# Altium schematic sheet Capteur.SchDoc
size A4; Author: Audran; CompanyName: Goldorak; Address1: Electrolab; Address2: 52 rue Paul Lescop; Address3: 92000 Nanterre; DocumentNumber: 5; SheetNumber: 5; SheetTotal: 8; ProjectName: Cartes_2017
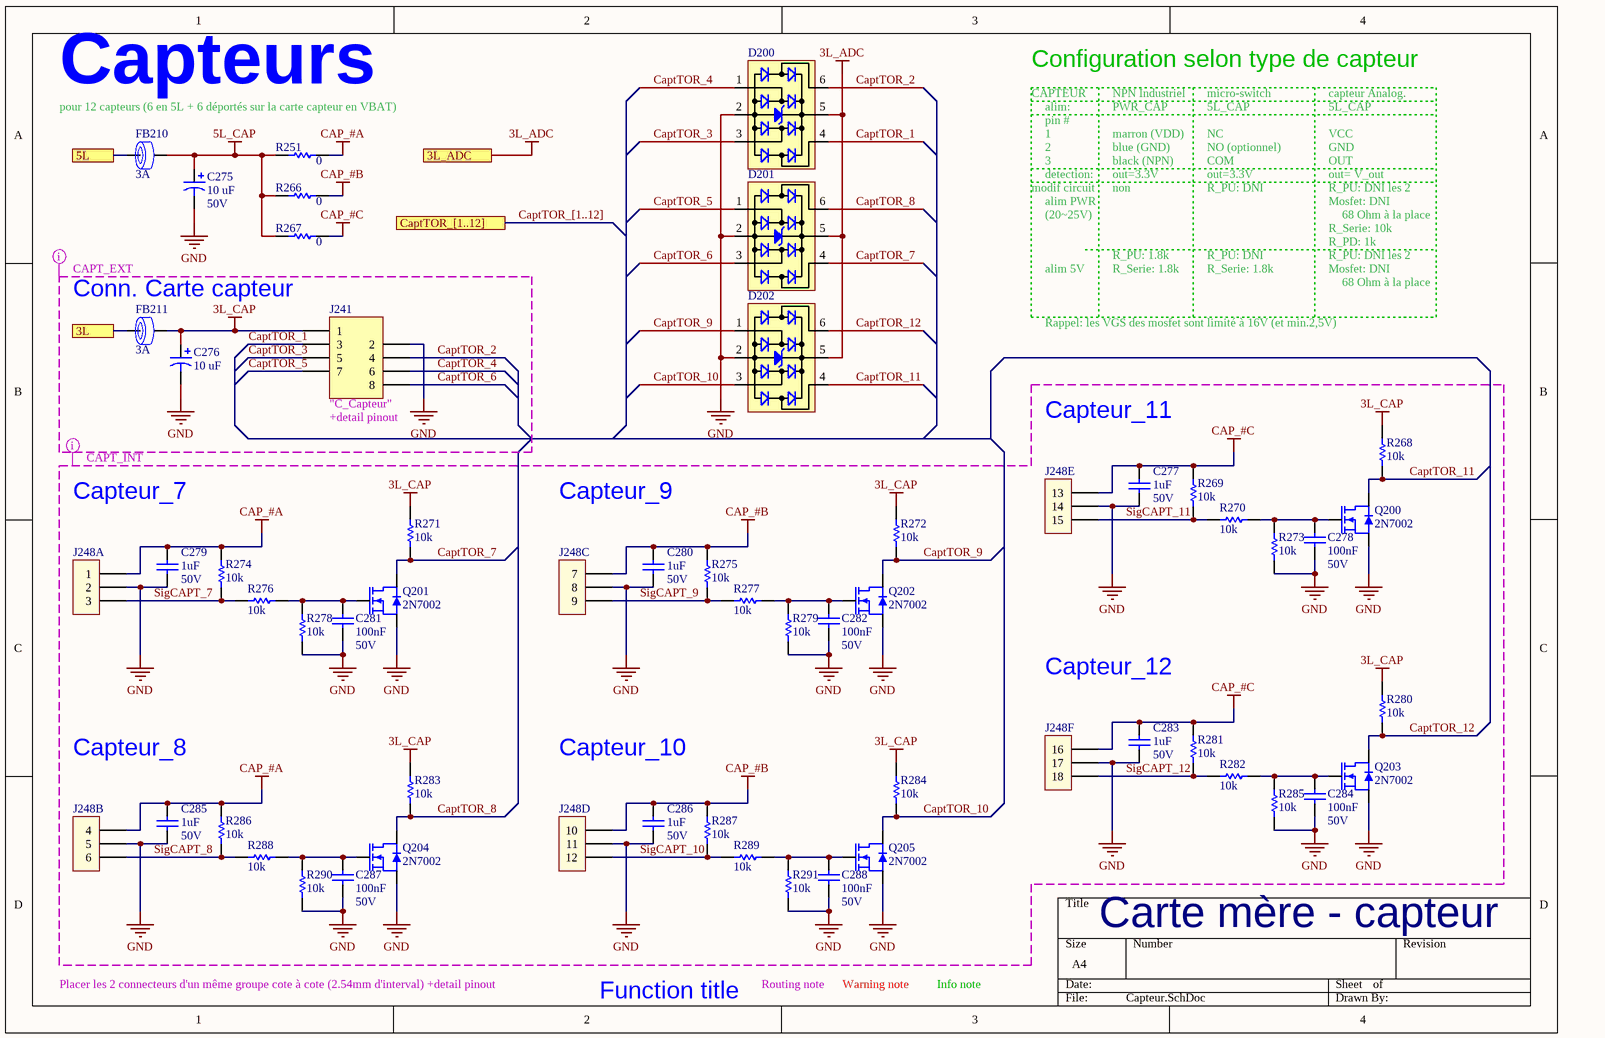
[diagram p0: Capteur.SchDoc]

## Parts
C275  10 uF  RatedVoltage: 50V  [WCAP-ATG8_5x11x2x0.5]
C276  10 uF  [WCAP-ATG8_5x11x2x0.5]
C277  1uF  RatedVoltage: 50V  [WCAP-CSGP_0805, 2x1.25x1.25]
C278  100nF  RatedVoltage: 50V  [WCAP-CSGP_0603, 1.6x0.8x0.8]
C279  1uF  RatedVoltage: 50V  [WCAP-CSGP_0805, 2x1.25x1.25]
C280  1uF  RatedVoltage: 50V  [WCAP-CSGP_0805, 2x1.25x1.25]
C281  100nF  RatedVoltage: 50V  [WCAP-CSGP_0603, 1.6x0.8x0.8]
C282  100nF  RatedVoltage: 50V  [WCAP-CSGP_0603, 1.6x0.8x0.8]
C283  1uF  RatedVoltage: 50V  [WCAP-CSGP_0805, 2x1.25x1.25]
C284  100nF  RatedVoltage: 50V  [WCAP-CSGP_0603, 1.6x0.8x0.8]
C285  1uF  RatedVoltage: 50V  [WCAP-CSGP_0805, 2x1.25x1.25]
C286  1uF  RatedVoltage: 50V  [WCAP-CSGP_0805, 2x1.25x1.25]
C287  100nF  RatedVoltage: 50V  [WCAP-CSGP_0603, 1.6x0.8x0.8]
C288  100nF  RatedVoltage: 50V  [WCAP-CSGP_0603, 1.6x0.8x0.8]
D200  824001  [SOT-23-6L]  (value not drawn)
D201  824001  [SOT-23-6L]  (value not drawn)
D202  824001  [SOT-23-6L]  (value not drawn)
FB210  RatedCurrent: 3A  [WE-CBF_0805_High Current]  (hidden comment: 742792023)
FB211  RatedCurrent: 3A  [WE-CBF_0805_High Current]  (hidden comment: 742792023)
J241  690367280876  [690367280876]  (value not drawn)
J248  TSW-106-08-F-T-RA  [TSW-106-08-F-T-RA]  (value not drawn)  (parts A,B,C,D,E,F of 6)
Q200  2N7002  [SOT-23]
Q201  2N7002  [SOT-23]
Q202  2N7002  [SOT-23]
Q203  2N7002  [SOT-23]
Q204  2N7002  [SOT-23]
Q205  2N7002  [SOT-23]
R251  value 0  [RESC1608X06N]  (hidden comment: RC0603FR-070RL)
R266  value 0  [RESC1608X06N]  (hidden comment: RC0603FR-070RL)
R267  value 0  [RESC1608X06N]  (hidden comment: RC0603FR-070RL)
R268  value 10k  [RESC1608X06N]  (hidden comment: RC0603FR-0710KL)
R269  value 10k  [RESC1608X06N]  (hidden comment: RC0603FR-0710KL)
R270  value 10k  [RESC1608X06N]  (hidden comment: RC0603FR-0710KL)
R271  value 10k  [RESC1608X06N]  (hidden comment: RC0603FR-0710KL)
R272  value 10k  [RESC1608X06N]  (hidden comment: RC0603FR-0710KL)
R273  value 10k  [RESC1608X06N]  (hidden comment: RC0603FR-0710KL)
R274  value 10k  [RESC1608X06N]  (hidden comment: RC0603FR-0710KL)
R275  value 10k  [RESC1608X06N]  (hidden comment: RC0603FR-0710KL)
R276  value 10k  [RESC1608X06N]  (hidden comment: RC0603FR-0710KL)
R277  value 10k  [RESC1608X06N]  (hidden comment: RC0603FR-0710KL)
R278  value 10k  [RESC1608X06N]  (hidden comment: RC0603FR-0710KL)
R279  value 10k  [RESC1608X06N]  (hidden comment: RC0603FR-0710KL)
R280  value 10k  [RESC1608X06N]  (hidden comment: RC0603FR-0710KL)
R281  value 10k  [RESC1608X06N]  (hidden comment: RC0603FR-0710KL)
R282  value 10k  [RESC1608X06N]  (hidden comment: RC0603FR-0710KL)
R283  value 10k  [RESC1608X06N]  (hidden comment: RC0603FR-0710KL)
R284  value 10k  [RESC1608X06N]  (hidden comment: RC0603FR-0710KL)
R285  value 10k  [RESC1608X06N]  (hidden comment: RC0603FR-0710KL)
R286  value 10k  [RESC1608X06N]  (hidden comment: RC0603FR-0710KL)
R287  value 10k  [RESC1608X06N]  (hidden comment: RC0603FR-0710KL)
R288  value 10k  [RESC1608X06N]  (hidden comment: RC0603FR-0710KL)
R289  value 10k  [RESC1608X06N]  (hidden comment: RC0603FR-0710KL)
R290  value 10k  [RESC1608X06N]  (hidden comment: RC0603FR-0710KL)
R291  value 10k  [RESC1608X06N]  (hidden comment: RC0603FR-0710KL)

## Ports
3L, 3L_ADC, 5L, CaptTOR_[1..12]

## Nets
3L_ADC: D200.5 D201.5 D202.5 ; port 3L_ADC
3L_CAP: C276.1 FB211.2 J241.1 R268.2 R271.2 R272.2 R280.2 R283.2 R284.2
5L_CAP: C275.1 FB210.2 R251.1 R266.1 R267.1
CAP_#A: C279.2 C285.2 J248.1 J248.4 R251.2 R274.2 R286.2
CAP_#B: C280.2 C286.2 J248.7 J248.10 R266.2 R275.2 R287.2
CAP_#C: C277.2 C283.2 J248.13 J248.16 R267.2 R269.2 R281.2
GND: C275.2 C276.2 C277.1 C278.2 C279.1 C280.1 C281.2 C282.2 C283.1 C284.2 C285.1 C286.1 C287.2 C288.2 D200.2 D201.2 D202.2 J241.2 J248.2 J248.5 J248.8 J248.11 J248.14 J248.17 Q200.2(S) Q201.2(S) Q202.2(S) Q203.2(S) Q204.2(S) Q205.2(S) R273.1 R278.1 R279.1 R285.1 R290.1 R291.1
3L: FB211.1 ; port 3L
5L: FB210.1 ; port 5L
CaptTOR_1: D200.4 J241.3
CaptTOR_2: D200.6 J241.4
CaptTOR_3: D200.3 J241.5
CaptTOR_4: D200.1 J241.6
CaptTOR_5: D201.1 J241.7
CaptTOR_6: D201.3 J241.8
CaptTOR_7: D201.4 Q201.3(D) R271.1
CaptTOR_8: D201.6 Q204.3(D) R283.1
CaptTOR_9: D202.1 Q202.3(D) R272.1
CaptTOR_10: D202.3 Q205.3(D) R284.1
CaptTOR_11: D202.4 Q200.3(D) R268.1
CaptTOR_12: D202.6 Q203.3(D) R280.1
SigCAPT_7: J248.3 R274.1 R276.1
SigCAPT_8: J248.6 R286.1 R288.1
SigCAPT_9: J248.9 R275.1 R277.1
SigCAPT_10: J248.12 R287.1 R289.1
SigCAPT_11: J248.15 R269.1 R270.1
SigCAPT_12: J248.18 R281.1 R282.1
NetC278_1: C278.1 Q200.1(G) R270.2 R273.2
NetC281_1: C281.1 Q201.1(G) R276.2 R278.2
NetC282_1: C282.1 Q202.1(G) R277.2 R279.2
NetC284_1: C284.1 Q203.1(G) R282.2 R285.2
NetC287_1: C287.1 Q204.1(G) R288.2 R290.2
NetC288_1: C288.1 Q205.1(G) R289.2 R291.2

## Buses and harness runs
bus CaptTOR_[1..12] = port CaptTOR_[1..12]

## Layout directives
net class CAPT_INT: 3L_CAP, CAP_#A, CAP_#B, CAP_#C, CaptTOR_7, CaptTOR_8, CaptTOR_9, CaptTOR_10, CaptTOR_11, CaptTOR_12, GND, SigCAPT_7, SigCAPT_8, SigCAPT_9, SigCAPT_10, SigCAPT_11, SigCAPT_12
net class CAPT_EXT: 3L_CAP, CaptTOR_1, CaptTOR_2, CaptTOR_3, CaptTOR_4, CaptTOR_5, CaptTOR_6, GND

## Notes on the sheet
- pour 12 capteurs (6 en 5L + 6 déportés sur la carte capteur en VBAT)
- Capteurs
- CAPTEUR
- Configuration selon type de capteur
- alim:
- NPN Industriel
- PWR_CAP
- micro-switch
- 5L_CAP
- capteur Analog.
- pin #
- 1
- 2
- 3
- detection:
- marron (VDD)
- blue (GND)
- black (NPN)
- out=3.3V
- NC
- NO (optionnel)
- COM
- VCC
- OUT
- GND
- out= V_out
- modif circuit
- alim PWR
- (20~25V)
- non
- R_PU: DNI
- R_PU: DNI les 2
- Mosfet: DNI
- R_Serie: 10k
- R_PD: 1k
- 68 Ohm à la place
- Conn. Carte capteur
- alim 5V
- R_PU: 1.8k
- R_Serie: 1.8k
- Rappel: les VGS des mosfet sont limité à 16V (et min.2,5V)
- (near J241) "C_Capteur"
- (near J241) +detail pinout
- Capteur_11
- Capteur_7
- Capteur_9
- Capteur_12
- Capteur_8
- Capteur_10
- Placer les 2 connecteurs d'un même groupe cote à cote (2.54mm d'interval) +detail pinout
- Routing note
- Warning note
- Info note
- Carte mère - capteur
- Function title

## Library data of the parts
C275 = WCAP-ATG8, 860010672009: CAP Alu 10 UF 20% 50 V; Manufacturer: Wurth Elektronik; ComponentLink1Description: Datasheet; ComponentLink1URL: http://katalog.we-online.de/pbs/datasheet/860010672009.pdf; Value: 10 uF; Size: 5mmx11mm; Manufacturer Part Number: 860010672009
C276 = WCAP-ATG8, 860010672009: CAP Alu 10 UF 20% 50 V; Manufacturer: Wurth Elektronik; RatedVoltage: 50V; ComponentLink1Description: Datasheet; ComponentLink1URL: http://katalog.we-online.de/pbs/datasheet/860010672009.pdf; Value: 10 uF; Size: 5mmx11mm; Manufacturer Part Number: 860010672009
C277 C279 C280 C283 C285 C286 = WCAP-CSGP, 885012207103: CAP CER 1uF 50V X7R 0805; Manufacturer: Wurth Elektronik; ComponentLink1Description: Datasheet; ComponentLink1URL: http://katalog.we-online.com/pbs/datasheet/885012207103.pdf; Manufacturer Part Number: 885012207103; Value: 1uF; Size: 0805; CeramicType: X7R; Supplier 2: JLCPCB; Supplier Part Number 2: C28323; Supplier Footprint 2: 0805
C278 C281 C282 C284 C287 C288 = WCAP-CSGP, 885012206095: CAP CER 100nF 50V X7R 0603; Manufacturer: Wurth Elektronik; ComponentLink1Description: Datasheet; ComponentLink1URL: http://katalog.we-online.com/pbs/datasheet/885012206095.pdf; Value: 100nF; Size: 0603; CeramicType: X7R; Manufacturer Part Number: 885012206095; Supplier 2: JLCPCB; Supplier Part Number 2: C14663; Supplier Footprint 2: 0603
D200-D202 = 824001: WE-TVS TVS Diode 4+1Ch 5V SOT23-6L; Manufacturer: Wurth Elektronik; ComponentLink1Description: Datasheet; ComponentLink1URL: https://www.we-online.com/catalog/datasheet/824001.pdf; Manufacturer Part Number: 824001; Supplier 1: Farnell; Supplier Part Number 1: 1748613; Type: TVS; Value: 5V; Supplier 2: JLCPCB; Supplier Part Number 2: C85364; Supplier Footprint 2: SOT-23-6L
FB210 FB211 = WE-CBF, 742792023: Ferrite Bead 120ohm 0805 3A; Manufacturer: Wurth Elektronik; Value: 120; ComponentLink1Description: Manufacturer; ComponentLink1URL: https://www.we-online.com/catalog/en/WE-CBF/?sq=742792023#742792023; ComponentLink2Description: Datasheet; ComponentLink2URL: https://www.we-online.com/catalog/datasheet/742792023.pdf; Manufacturer Part Number: 742792023; Supplier 2: JLCPCB; Supplier Part Number 2: C1015; Supplier 1: Farnell; Supplier Part Number 1: 1635732; Supplier Footprint 2: 0805
J241 = 690367280876: WR-MM 8p Female SMT Connector with Polarization; Manufacturer: Wurth Electronics Inc.; Value: 8; Manufacturer Part Number: 690367280876; ComponentLink1Description: Datasheet; ComponentLink1URL: http://katalog.we-online.de/em/datasheet/69036728xx76.pdf; Supplier 1: Farnell; Supplier Part Number 1: 1641850
J248 = TSW-106-08-F-T-RA: CONN HEADER R/A 3L x 6POS 2.54MM; Manufacturer: SAMTEC; Manufacturer Part Number: TSW-106-08-F-T-RA; ComponentLink1Description: Datasheet; ComponentLink1URL: http://cloud.samtec.com/catalog_english/TSW_TH.PDF; Supplier 1: Farnell; Supplier Part Number 1: 2053043
Q200-Q205 = 2N7002: MOSFET N 60V 115MA SOT23; Manufacturer: Changjiang Electronics Tech (CJ); Supplier 1: Farnell; Supplier Part Number 1: 1510761; Manufacturer Part Number: 2N7002; ComponentLink1Description: Datasheet; ComponentLink1URL: https://datasheet.lcsc.com/szlcsc/1810151612_Changjiang-Electronics-Tech-CJ-2N7002_C8545.pdf; Supplier 2: JLCPCB; Supplier Part Number 2: C8545; Supplier Footprint 2: SOT-23-3
R251 R266 R267 = RC0603FR-070RL: RES SMD 0 OHM 1% 1/10W 0603; Manufacturer: Yageo; Power: 100mW; Vmax: 50V; Manufacturer Part Number: RC0603FR-070RL; Type: Thick Film; ComponentLink1Description: Manufacturer; ComponentLink1URL: http://www.yageo.com/NewPortal/_en/index.jsp; ComponentLink2Description: Datasheet; ComponentLink2URL: http://www.farnell.com/datasheets/2167052.pdf; Supplier 1: Farnell; Precision: ±1%; Supplier Part Number 1: 2309106; Supplier 2: JLCPCB; Supplier Part Number 2: C21189; Supplier Footprint 2: 0603
R268-R291 = RC0603FR-0710KL: RES SMD 10K OHM 1% 1/10W 0603; Manufacturer: Yageo; Power: 100mW; Vmax: 50V; Manufacturer Part Number: RC0603FR-0710KL; Type: Thick Film; ComponentLink1Description: Manufacturer; ComponentLink1URL: http://www.yageo.com/NewPortal/_en/index.jsp; ComponentLink2Description: Datasheet; ComponentLink2URL: http://www.farnell.com/datasheets/2167052.pdf; Supplier 1: Farnell; Supplier Part Number 1: 9238603; Precision: ±1%; Supplier 2: JLCPCB; Supplier Part Number 2: C25804; Supplier Footprint 2: 0603